# Altium schematic sheet Voeding.SchDoc
size A4; SheetNumber: 1; SheetTotal: 5
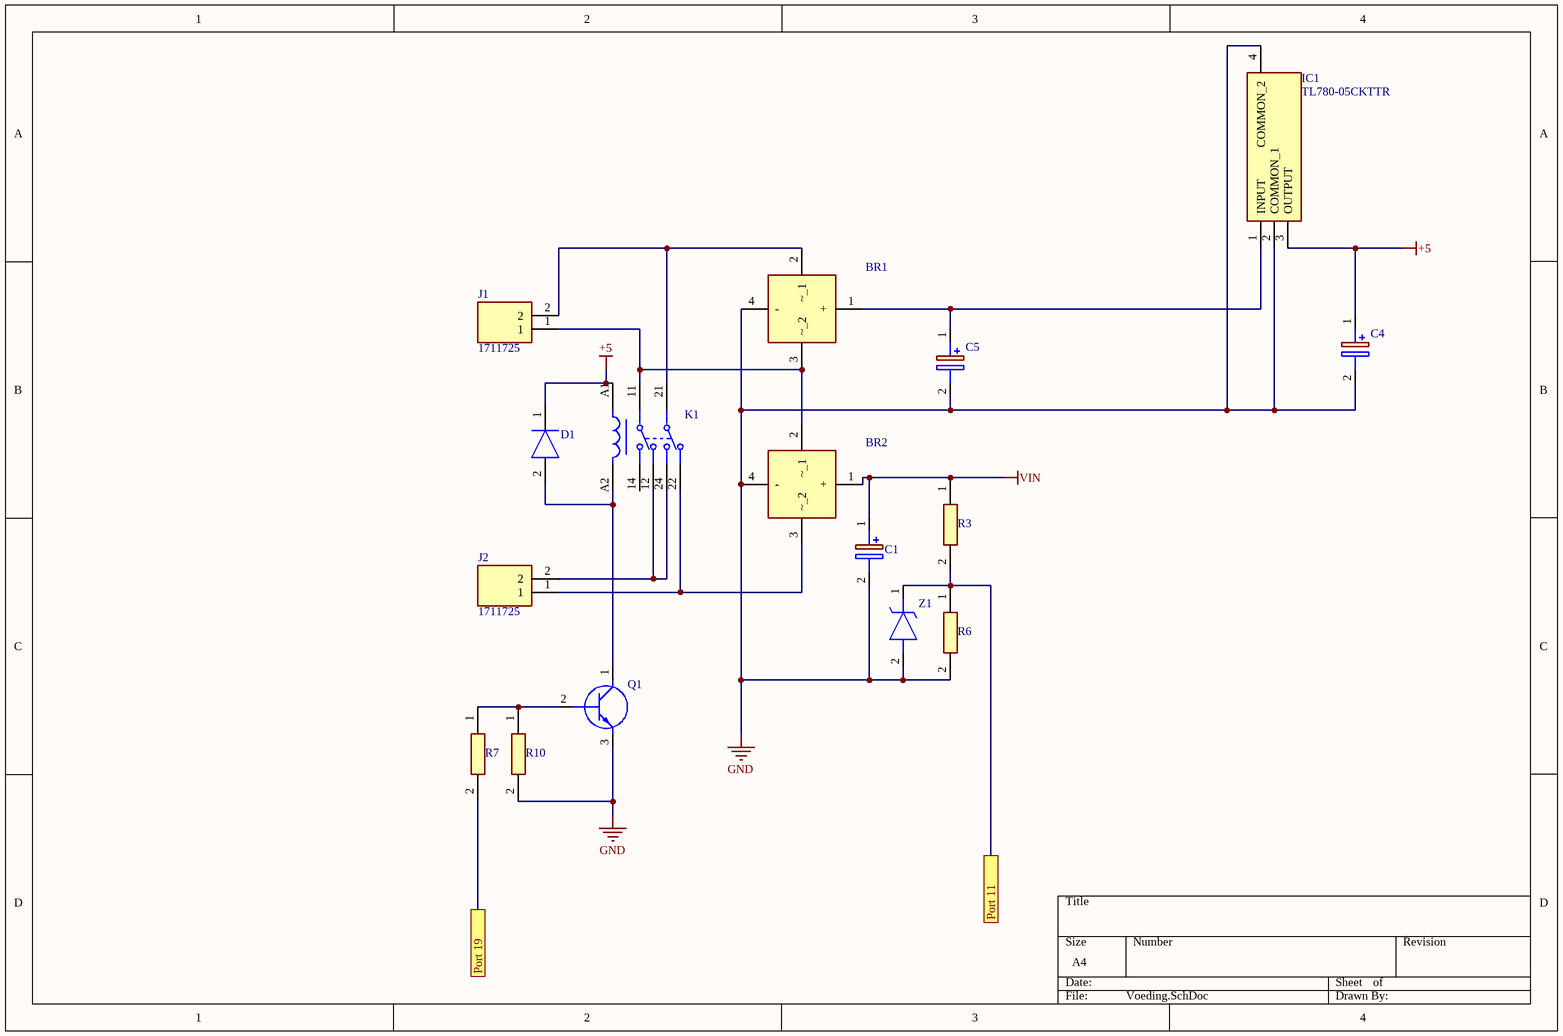
[diagram p0: Voeding.SchDoc]

## Parts
BR1  GBU6J-E3_45  [Bridge rectifier]  (value not drawn)
BR2  GBU6J-E3_45  [Bridge rectifier]  (value not drawn)
C1  ESK478M050AQ3AA  [4700µF 50V]  (value not drawn)
C4  EEU-FR1H100  [10µF 50V]  (value not drawn)
C5  EEU-FR1H100  [100µF]  (value not drawn)
D1  1N4007G-T  [D1]  (value not drawn)
IC1  TL780-05CKTTR  [IC1]
J1  1711725  [Phoenix]
J2  1711725  [Phoenix]
K1  RT424615  [FP-RT424615-MFG]  (value not drawn)
Q1  BC547CBU  [TTTT]  (value not drawn)
R3  CRCW080510K0DHEAP  [Resistor]  (value not drawn)
R6  CRCW080510K0DHEAP  [Resistor]  (value not drawn)
R7  CRCW080510K0DHEAP  [Resistor]  (value not drawn)
R10  CRCW08054K70FKEAHP  [Resistor]  (value not drawn)
Z1  SZMMSZ5231BT1G  [Zener]  (value not drawn)

## Ports
Port 11, Port 19

## Nets
+5: C4.1(+) D1.1(K) IC1.3(OUTPUT) K1.A1
GND: BR1.4(-) BR2.4(-) C1.2(-) C4.2(-) C5.2(-) IC1.2(COMMON_1) IC1.4(COMMON_2) Q1.3(E) R6.2 R10.2 Z1.2(A)
VIN: BR2.1(+) C1.1(+) R3.1
Port 11: R3.2 R6.1 Z1.1(K) ; port Port 11
Port 19: R7.2 ; port Port 19
NetBR1_1: BR1.1(+) C5.1(+) IC1.1(INPUT)
NetBR1_2: BR1.2(~_1) J1.2 K1.21
NetBR1_3: BR1.3(~_2) BR2.2(~_1) J1.1 K1.11
NetBR2_3: BR2.3(~_2) J2.1 K1.22
NetD1_2: D1.2(A) K1.A2 Q1.1(C)
NetJ2_2: J2.2 K1.12 K1.24
NetQ1_2: Q1.2(B) R7.1 R10.1

Not connected (* = marked no-connect by the designer): K1 14

## Library data of the parts
BR1 BR2 = GBU6J-E3_45: Bridge Rectifier; Manufacturer_Name: Vishay; Manufacturer_Part_Number: GBU6J-E3/45; Datasheet Link: http://www.vishay.com/docs/88615/gbu6a.pdf; Height: 18.8mm
C1 = ESK478M050AQ3AA: Capacitor Polarised 50V 4700uF; Manufacturer_Name: Kemet; Datasheet Link: https://componentsearchengine.com//ESK478M050AQ3AA.pdf; Height: 37mm; Mouser2 Part Number: 80-ESK478M050AQ3AA; Mouser2 Price/Stock: https://www.mouser.com/Search/Refine.aspx?Keyword=80-ESK478M050AQ3AA; Manufacturer_Part_Number: ESK478M050AQ3AA
C4 C5 = EEU-FR1H100: Capacitor Polarised 50VDC 10uF; Manufacturer_Name: Panasonic; Datasheet Link: https://componentsearchengine.com//EEU-FR1H100.pdf; Height: 12.5mm; Mouser2 Part Number: 667-EEU-FR1H100; Mouser2 Price/Stock: https://www.mouser.com/Search/Refine.aspx?Keyword=667-EEU-FR1H100; Manufacturer_Part_Number: EEU-FR1H100
D1 = 1N4007G-T: Diode; Manufacturer_Name: Diodes Inc.; Datasheet Link: https://componentsearchengine.com//1N4007G-T.pdf; Mouser2 Part Number: 621-1N4007G-T; Mouser2 Price/Stock: https://www.mouser.com/Search/Refine.aspx?Keyword=621-1N4007G-T; Manufacturer_Part_Number: 1N4007G-T
IC1 = TL780-05CKTTR: Integrated Circuit; Manufacturer_Name: Texas Instruments; Datasheet Link: http://www.ti.com/general/docs/suppproductinfo.tsp?distId=26&gotoUrl=http%3A%2F%2Fwww.ti.com%2Flit%2Fgpn%2Ftl780; Height: 5.08mm; Manufacturer_Part_Number: TL780-05CKTTR
J1 J2 = 1711725: Connector; Manufacturer_Name: Phoenix Contact; Datasheet Link: http://www.phoenixcontact.com/de/produkte/1711725/pdf; Height: 18.2mm; Manufacturer_Part_Number: 1711725
K1 = CMP-03395-000241-1: RELAY GEN PURPOSE DPDT 8A 115V; Max Current Rating: 15A; Ratings: IP54; Coil Type: Non-Latching; Power Rating: 760mW; Max Voltage Rating (AC): 400V; Coil Resistance: 8.1kR; Operate Time: 8ms; Approvals: CSA; Application(s): POWER; Relay Type: General Purpose; Switching Capacity: 2kW; Length: 29mm; Switching Current: 8A; Mount: Through Hole; Contact Current Rating: 8A; Coil Voltage (AC): 115V; Voltage Rating (AC): 400V; Width: 12.7mm; Radiation Hardening: No; Case/Package: DIP; Current Rating: 8A; Number of Pins: 8; Height: 15.7mm; Series: RT2, SCHRACK; Throw Configuration: DPDT; Packaging: Rail/Tube; Package Quantity: 500; Min Operating Temperature: -40°C; Termination: PC Pin; RoHS Compliant: Yes; Depth: 12.7mm; Max Operating Temperature: 70°C; Contact Material: Silver
Q1 = BC547CBU: Transistor BJT NPN; Manufacturer_Name: ON Semiconductor; Datasheet Link: https://www.onsemi.com/pdf/datasheet/bc550-d.pdf; Height: 5.33mm; Manufacturer_Part_Number: BC547CBU
R3 = CRCW080510K0DHEAP: Resistor 68KOhm; Manufacturer_Name: Vishay; Datasheet Link: https://www.arrow.com/en/products/crcw080510k0dheap/vishay; Height: 0.5mm; Manufacturer_Part_Number: CRCW080510K0DHEAP
R6 R7 = CRCW080510K0DHEAP: Resistor 10KOhm; Manufacturer_Name: Vishay; Datasheet Link: https://www.arrow.com/en/products/crcw080510k0dheap/vishay; Height: 0.5mm; Manufacturer_Part_Number: CRCW080510K0DHEAP
R10 = CRCW08054K70FKEAHP: Resistor 4.7KOhm; Manufacturer_Name: Vishay; Datasheet Link: https://componentsearchengine.com//CRCW08054K70FKEAHP.pdf; Height: 0.5mm; Mouser2 Part Number: 71-CRCW08054K70FKEAH; Mouser2 Price/Stock: https://www.mouser.com/Search/Refine.aspx?Keyword=71-CRCW08054K70FKEAH; Manufacturer_Part_Number: CRCW08054K70FKEAHP
Z1 = SZMMSZ5231BT1G: Zener Diode; Manufacturer_Name: ON Semiconductor; Datasheet Link: https://componentsearchengine.com//SZMMSZ5231BT1G.pdf; Height: 1.35mm; Mouser2 Part Number: 863-SZMMSZ5231BT1G; Mouser2 Price/Stock: https://www.mouser.com/Search/Refine.aspx?Keyword=863-SZMMSZ5231BT1G; Manufacturer_Part_Number: SZMMSZ5231BT1G